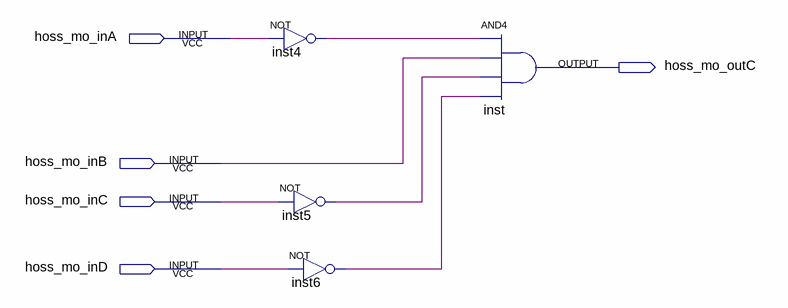
[diagram p0: schematic sheet]
// Quartus schematic segmentC.bdf as structural Verilog: 4 symbols, 5 pins
module segmentC (
  input  hoss_mo_inA,
  input  hoss_mo_inB,
  input  hoss_mo_inC,
  input  hoss_mo_inD,
  output hoss_mo_outC
);

  wire inst4_out, inst5_out, inst6_out;

  not inst4 (inst4_out, hoss_mo_inA);
  not inst5 (inst5_out, hoss_mo_inC);
  not inst6 (inst6_out, hoss_mo_inD);
  and inst (hoss_mo_outC, inst4_out, hoss_mo_inB, inst5_out, inst6_out);
endmodule
